# EAGLE design SLIM-ADC-16 (EAGLE 6.1)
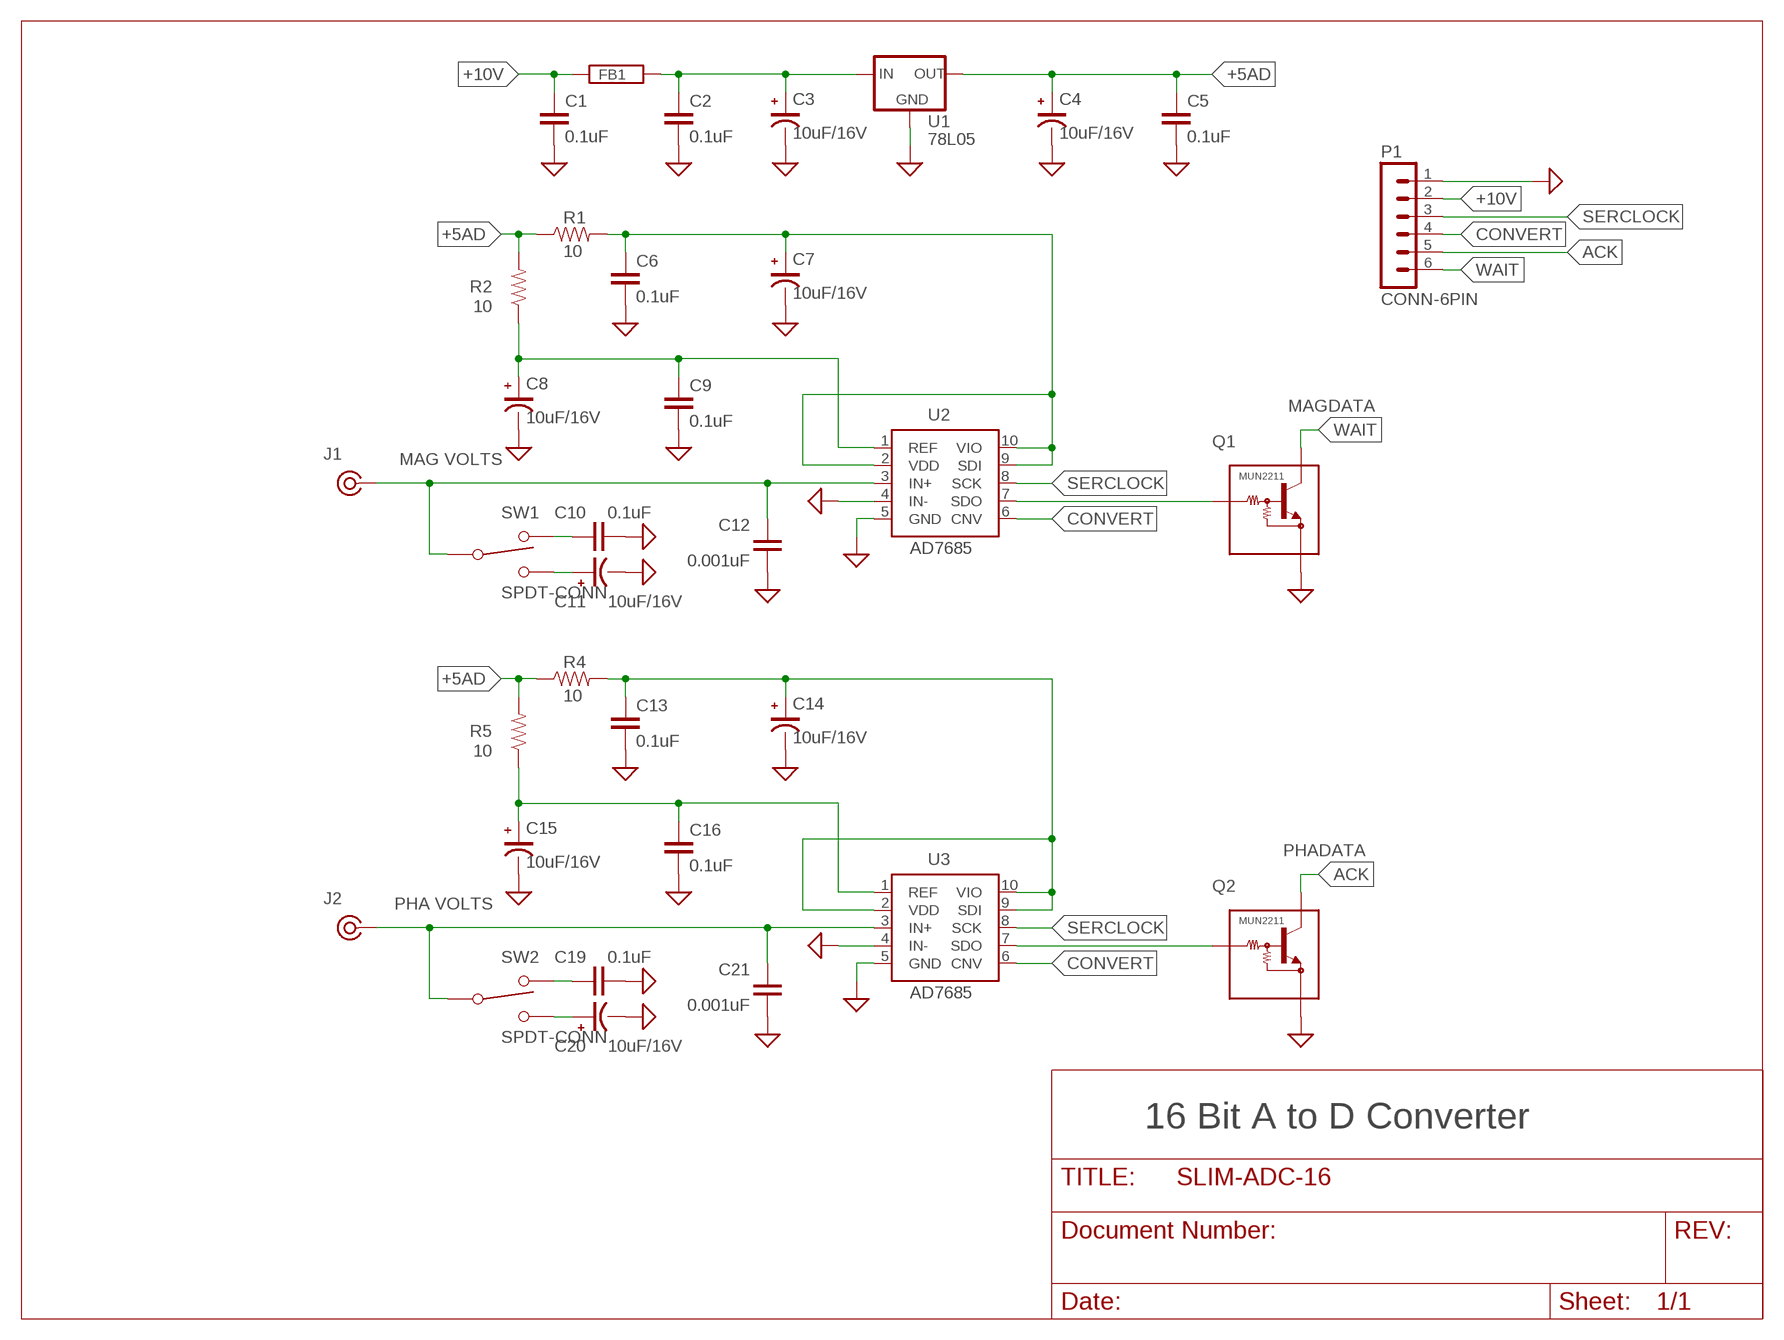
[diagram p0: schematic, sheet 1]

## Parts
C1  0.1uF  CAP0805  [0805]
C2  0.1uF  CAP0805  [0805]
C3  10uF/16V  CAP-POL1206  [EIA3216]
C4  10uF/16V  CAP-POL1206  [EIA3216]
C5  0.1uF  CAP0805  [0805]
C6  0.1uF  CAP0805  [0805]
C7  10uF/16V  CAP-POL1206  [EIA3216]
C8  10uF/16V  CAP-POL1206  [EIA3216]
C9  0.1uF  CAP0805  [0805]
C10  0.1uF  CAP0805  [0805]
C11  10uF/16V  CAP-POL1206  [EIA3216]
C12  0.001uF  CAP0805  [0805]
C13  0.1uF  CAP0805  [0805]
C14  10uF/16V  CAP-POL1206  [EIA3216]
C15  10uF/16V  CAP-POL1206  [EIA3216]
C16  0.1uF  CAP0805  [0805]
C19  0.1uF  CAP0805  [0805]
C20  10uF/16V  CAP-POL1206  [EIA3216]
C21  0.001uF  CAP0805  [0805]
FB1  FERRITE0805  [0805]
J1  COAX  [SLIM_COAX_PAD]
J2  COAX  [SLIM_COAX_PAD]
P1  CONN-6PIN  [CONN-6PIN]
Q1  MUN2211  [SOT23]
Q2  MUN2211  [SOT23]
R1  10  RESISTOR0805  [0805]
R2  10  RESISTOR0805  [0805]
R4  10  RESISTOR0805  [0805]
R5  10  RESISTOR0805  [0805]
SW1  SPDT-CONN  [CONN-3PIN]
SW2  SPDT-CONN  [CONN-3PIN]
U1  78L05  78MXXLSOT-89  [SOT89]
U2  AD7685  [MSOP10]
U3  AD7685  [MSOP10]

## Nets
+5AD: C4.A(+) C5.1 R1.1 R2.2 R4.1 R5.2 U1.1(OUT)
+10V: C1.1 FB1.1 P1.2
ACK: P1.5 Q2.C
CONVERT: P1.4 U2.6(CNV) U3.6(CNV)
GND: C1.2 C2.2 C3.C(-) C4.C(-) C5.2 C6.2 C7.C(-) C8.C(-) C9.2 C10.2 C11.C(-) C12.2 C13.2 C14.C(-) C15.C(-) C16.2 C19.2 C20.C(-) C21.2 P1.1 Q1.E Q2.E U1.2(GND) U1.4(GND) U2.4(IN-) U2.5(GND) U3.4(IN-) U3.5(GND)
N$1: C8.A(+) C9.1 R2.1 U2.1(REF)
N$2: C6.1 C7.A(+) R1.2 U2.2(VDD) U2.9(SDI) U2.10(VIO)
N$3: C12.1 J1.P$1 SW1.2 U2.3(IN+)
N$4: C10.1 SW1.1
N$5: C11.A(+) SW1.3
N$6: Q1.B U2.7(SDO)
N$7: C2.1 C3.A(+) FB1.2 U1.3(IN)
N$8: C15.A(+) C16.1 R5.1 U3.1(REF)
N$9: C13.1 C14.A(+) R4.2 U3.2(VDD) U3.9(SDI) U3.10(VIO)
N$10: C21.1 J2.P$1 SW2.2 U3.3(IN+)
N$11: C19.1 SW2.1
N$12: C20.A(+) SW2.3
N$13: Q2.B U3.7(SDO)
SERCLOCK: P1.3 U2.8(SCK) U3.8(SCK)
WAIT: P1.6 Q1.C

## Notes on the sheet
- MAGDATA
- MAG VOLTS
- PHADATA
- PHA VOLTS
- 16 Bit A to D Converter

## Power pins joined to a net without a drawn wire
GND: J1.P$2 J2.P$2

## Library data of the parts
C1 C2 C5 C6 C9 C10 C12 C13 C16 C19 C21 = SLIM:CAP: Capacitor Standard 0603 ceramic capacitor, and 0.1" leaded capacitor.
C3 C4 C7 C8 C11 C14 C15 C20 = SLIM:CAP-POL
FB1 = SLIM:FERRITE
J1 J2 = SLIM:COAX
P1 = SLIM:CONN-6PIN: PIN HEADER; OC_FARNELL: unknown; OC_NEWARK: unknown
Q1 Q2 = SLIM:MUN2211*: NPN Bias Resistor Transistor
R1 R2 R4 R5 = SLIM:RESISTOR: Resistor Basic schematic elements and footprints for 0603, 1206, and PTH resistors.
SW1 SW2 = SLIM:SPDT
U1 = SLIM:78MXXL: VOLTAGE REGULATOR
U2 U3 = SLIM:AD7685

## Board

Size 30.48 x 30.48 mm. Coordinates in mm from the lower left corner, seen from the top.
Outline: 0,0 30.48,0 30.48,30.48 0,30.48 0,0
Copper layers (1*16): Top 0.035mm / dielectric 1.5mm / Bottom 0.035mm
Design rules: minimum track width 8mil, minimum drill 20mil, track to track 8mil, track to pad 8mil, pad to pad 8mil, via to via 8mil, smd to smd 6mil, copper to edge 5mil, drill to drill 8mil, minimum pad ring 12mil, minimum via ring 10mil, stop-mask expansion 1mil, vias tented up to drill 25mil, thermal gap 10mil

### Footprints (pad centres in the part's own frame; a part is rotated, then mirrored left to right if it is on the bottom)
0805 = smd 0.8 x 1.2: 1 -0.9,0; 2 0.9,0
EIA3216 = smd 1.4 x 1.6: A 1.4,0; C -1.4,0
SLIM_COAX_PAD = drill 0.508 pad 1.016: P$1 0,0 | smd 1.27 x 0.635 bottom: P$2 0,-1.397
CONN-6PIN = drill 1.016 square: 1 -6.35,0 | drill 1.016: 2 -3.81,0; 3 -1.27,0; 4 1.27,0; 5 3.81,0; 6 6.35,0
SOT23 = smd 0.8 x 0.9: B 0.95,1; C 0,-1; E -0.95,1
CONN-3PIN = drill 1.016 square: 1 -2.54,0 | drill 1.016: 2 0,0; 3 2.54,0
SOT89 = smd 1.2 x 1.5: 1 -1.6,-2; 3 1.6,-2 | smd 1 x 1.5: 2 0,-2 | smd 2.4 x 3: 4 0,1.25
MSOP10 = smd 0.34 x 1.04: 1 -1,-2.2; 2 -0.5,-2.2; 3 0,-2.2; 4 0.5,-2.2; 5 1,-2.2; 6 1,2.2; 7 0.5,2.2; 8 0,2.2; 9 -0.5,2.2; 10 -1,2.2

### Placement (x,y rotation side)
C1  3,8 0 top
C2  7.5,3.5 270 top
C3  4,4 0 top
C4  17.5,5 90 top
C5  14.5,3.5 270 top
C6  21,10 0 top
C7  21.5,12.5 180 top
C8  27,16.5 270 top
C9  25.5,13 180 top
C10  21.5,23.75 270 top
C11  27,22 90 top
C12  23.5,21.5 180 top
C13  6.5,10 0 top
C14  7,12.5 180 top
C15  10.5,9.5 0 top
C16  11,13 180 top
C19  7.5,23.75 270 top
C20  14.5,22 90 top
C21  11.5,21.5 0 top
FB1  3,6.5 0 top
J1  23,19.5 0 top
J2  9,19.5 0 top
P1  3,16.5 90 top
Q1  4,26 270 top
Q2  6,20 270 top
R1  20,7.5 90 top
R2  26,7.5 270 top
R4  6.5,8 180 top
R5  14.5,7.5 270 top
SW1  24.5,26.5 0 top
SW2  10.5,26.5 0 top
U1  11,4.5 180 top
U2  22.5,15.5 90 top
U3  8.5,15.5 90 top

### Tracks (layer width: path | path; a pad name or v marks a point on that pad's centre or on a via)
+5AD  (1 unrouted)
  Top 0.635: R5.2 12.7,6.6 U1.1 | C5.1 R5.2 | R5.2 17.3,6.6 C4.A 17.7,6.6 R1.1 R2.2 | R4.1 11.5,8 12.5,7.5 12.5,6.5
+10V  (1 unrouted)
  Top 0.381: P1.2 1.8,11.49 1.8,8.3 2,8.1 2,8
  Top 0.508: FB1.1 2.1,7.9 2,8
ACK
  Top 0.254: P1.5 5.07,20.31 5,20.24 Q2.C
CONVERT
  Top 0.254: U2.6 20.3,17.7 19,18.5 19,24.75 15.5,28.25 5,28.25 4,27.5 4,24 6,22 6,18.5 P1.4 U3.6
GND  (via drill 0.51)
  Top 0.254: C12.2 22.5,21.5 | U3.5 10.5,16.5 | U2.5 U2.4
  Top 0.34: U3.4 10.7,16.3
  Top 0.381: 10.7,16.3 10.5,16.5
  Top 0.508: C1.2 3.9,9.25 P1.1
  other vias: 0.64,15.24 0.64,19.05 0.64,22.86 0.64,26.67 0.64,29.84 0.64,11.43 0.64,7.62 0.64,3.81 0.64,0.64 3.81,0.64 7.62,0.64 11.43,0.64 15.24,0.64 19.05,0.64 22.86,0.64 26.67,0.64 29.84,0.64 29.84,3.81 29.84,7.62 29.84,11.43 29.84,15.24 29.84,19.05 29.84,22.86 29.84,26.67 29.84,29.84 26.67,29.84 22.86,29.84 19.05,29.84 15.24,29.84 11.43,29.84 7.62,29.84 3.81,29.84 5,26.05 7.25,11.25 9.25,14 23.25,14 23,10.5 24.5,17.5 10.5,17.5 21.5,21.75 8,21.75
  pour Top (no thermals): 0,0 30.48,0 30.48,30.48 0,30.48
  pour Bottom (no thermals): 0,0 30.48,0 30.48,30.48 0,30.48
N$1
  Top 0.34: U2.1 26.5,14.5
  Top 0.381: C8.A 26.6,15.1 arc90 26.5,15
  Top 0.635: R2.1 arc90 26.4,8.8 C9.1 arc90 26.5,13.1 26.5,14.5 26.5,15
N$2
  Top 0.34: U2.2 20.5,15 U2.9 20.2,15 20.1,14.9
  Top 0.356: U2.10 20.1,14.5
  Top 0.381: C7.A 20.1,14.5 20.1,14.9
  Top 0.635: R1.2 20,9.9 arc-90 C6.1 C7.A
N$3
  Top 0.34: 24,15.5 U2.3
  Top 0.381: C12.1 24.5,21 | 23,16 24,15.5
  Top 1.016: SW1.2 24.5,21 J1.P$1 23,16
N$4  (1 unrouted)
  Top 1.016: C10.1 22,26.5
N$5  (1 unrouted)
  Top 1.016: SW1.3 27,23.5
N$6
  Top 0.254: U2.7 18.5,16 18,16.5 18,24.5 14.75,27.75 6.75,27.75 6.5,27.5 6.5,26 5.5,25 5.05,25 Q1.B
N$7
  Top 0.635: FB1.2 5.5,4.9 5.5,4.5 | 5.5,4.5 5.5,4 C3.A | 5.5,4.5 5.9,4.5 6,4.4 C2.1 7.5,4.6 U1.3
N$8
  Top 0.356: 12,14.5 U3.1 10.5,14.5
  Top 0.381: 11.9,13.1 12,13.2 12,14.5
  Top 0.635: 11.9,13.1 C16.1 C15.A R5.1
N$9  (1 unrouted)
  Top 0.34: U3.10 5.5,14.5 | U3.2 U3.9 5.5,15
  Top 0.381: C14.A 5.5,13.1 5.5,14.5 5.5,15
  Top 0.635: R4.2 5.6,9.9 5.5,10.5 | C13.1 C14.A
N$10
  Top 0.34: 9.5,15.5 U3.3 11,15.5
  Top 0.381: 9,16 9.5,15.5 | C21.1 10.5,21.5
  Top 1.016: SW2.2 10.5,21.5 10.5,21 J2.P$1 9,16
N$11
  Top 1.016: C19.1 SW2.1
N$12
  Top 1.016: SW2.3 C20.A
N$13
  Top 0.254: Q2.B 7.5,18.75 7.5,16.5 7,16 U3.7
SERCLOCK
  Top 0.254: U2.8 21,15.5 21.5,16 21.5,18.5 20,20 20,25 16.25,28.75 3.25,28.75 1.75,27.25 1.75,16 2.52,15.23 P1.3 4.23,15.23 4.5,15.5 U3.8
WAIT  (1 unrouted)
  Top 0.254: Q1.C 3,23

### Text on the board
tPlace: REV 0 | PWB-ADC16 | AH